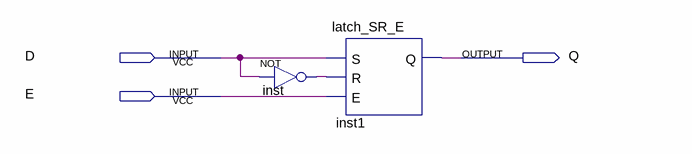
[diagram p0: schematic sheet]
// Quartus schematic latch_D.bdf as structural Verilog: 2 symbols, 3 pins
module latch_D (
  input  D,
  input  E,
  output Q
);

  wire inst_out;

  not inst (inst_out, D);
  latch_SR_E inst1 (.S(D), .R(inst_out), .E(E), .Q(Q));
endmodule
